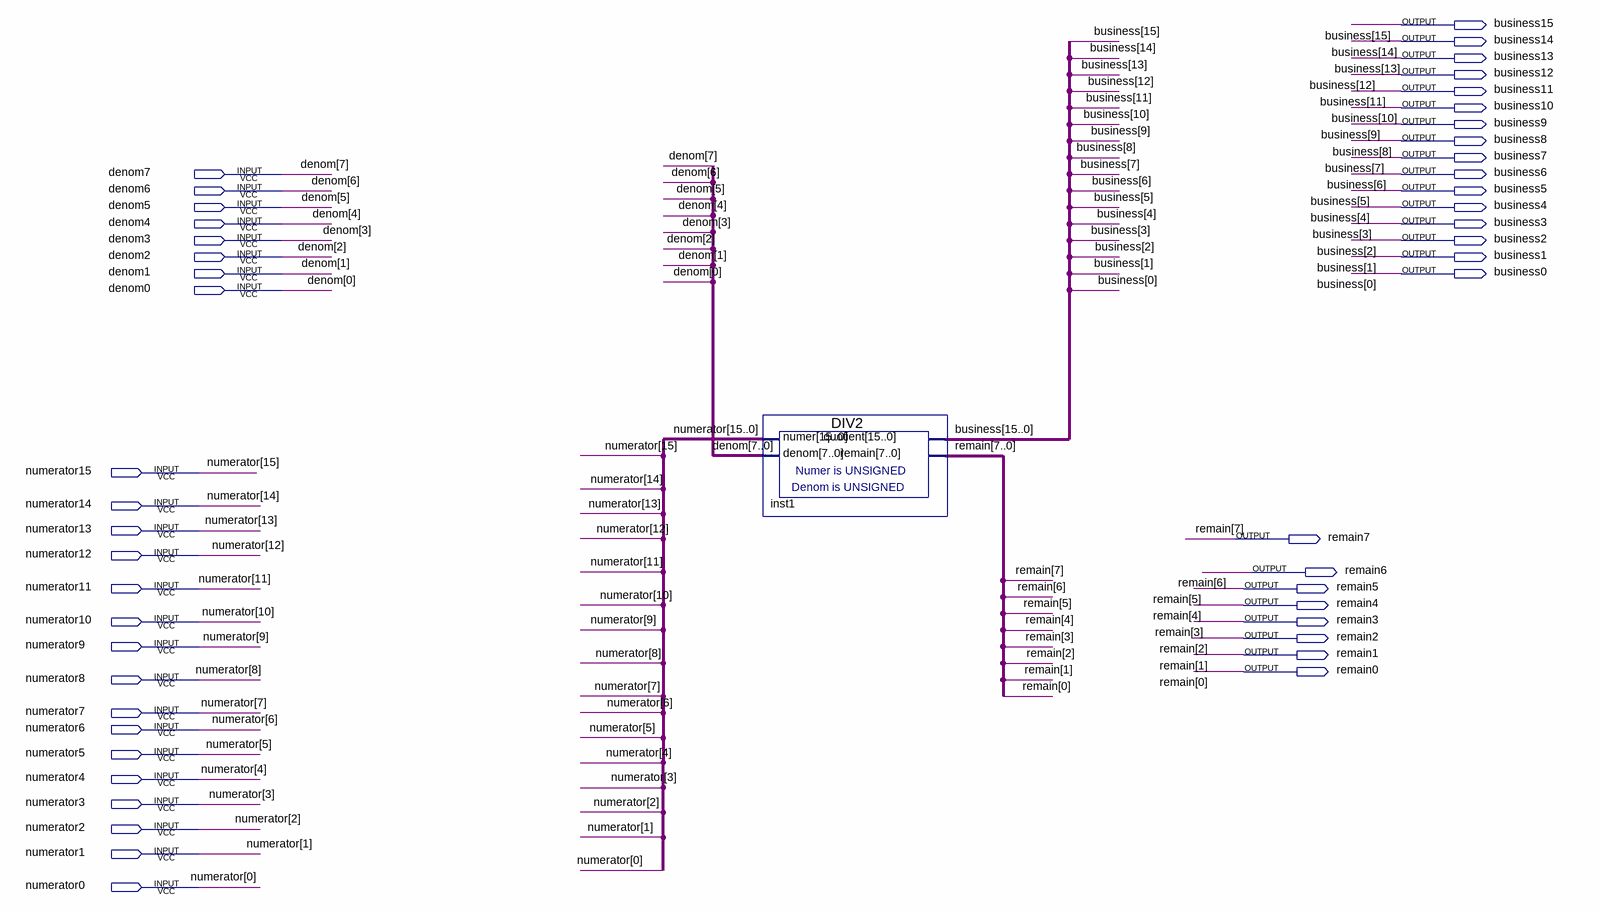
[diagram p0: schematic sheet]
// Quartus schematic chufa.bdf as structural Verilog: 1 symbols, 48 pins
module chufa (
  input  denom7,
  input  denom6,
  input  denom5,
  input  denom4,
  input  denom3,
  input  denom2,
  input  denom1,
  input  denom0,
  input  numerator15,
  input  numerator14,
  input  numerator13,
  input  numerator12,
  input  numerator11,
  input  numerator10,
  input  numerator9,
  input  numerator8,
  input  numerator7,
  input  numerator6,
  input  numerator5,
  input  numerator4,
  input  numerator3,
  input  numerator2,
  input  numerator1,
  input  numerator0,
  output business15,
  output business14,
  output business13,
  output business12,
  output business11,
  output business10,
  output business9,
  output business8,
  output business7,
  output business6,
  output business5,
  output business4,
  output business3,
  output business2,
  output business1,
  output business0,
  output remain7,
  output remain6,
  output remain5,
  output remain4,
  output remain3,
  output remain2,
  output remain1,
  output remain0
);

  DIV2 inst1 (
    .numer({numerator15, numerator14, numerator13, numerator12, numerator11, numerator10, numerator9, numerator8, numerator7, numerator6, numerator5, numerator4, numerator3, numerator2, numerator1, numerator0}),
    .denom({denom7, denom6, denom5, denom4, denom3, denom2, denom1, denom0}),
    .quotient({business15, business14, business13, business12, business11, business10, business9, business8, business7, business6, business5, business4, business3, business2, business1, business0}),
    .remain({remain7, remain6, remain5, remain4, remain3, remain2, remain1, remain0}));
endmodule
